# EasyEDA Pro project PCB.epro, board PCB1_1
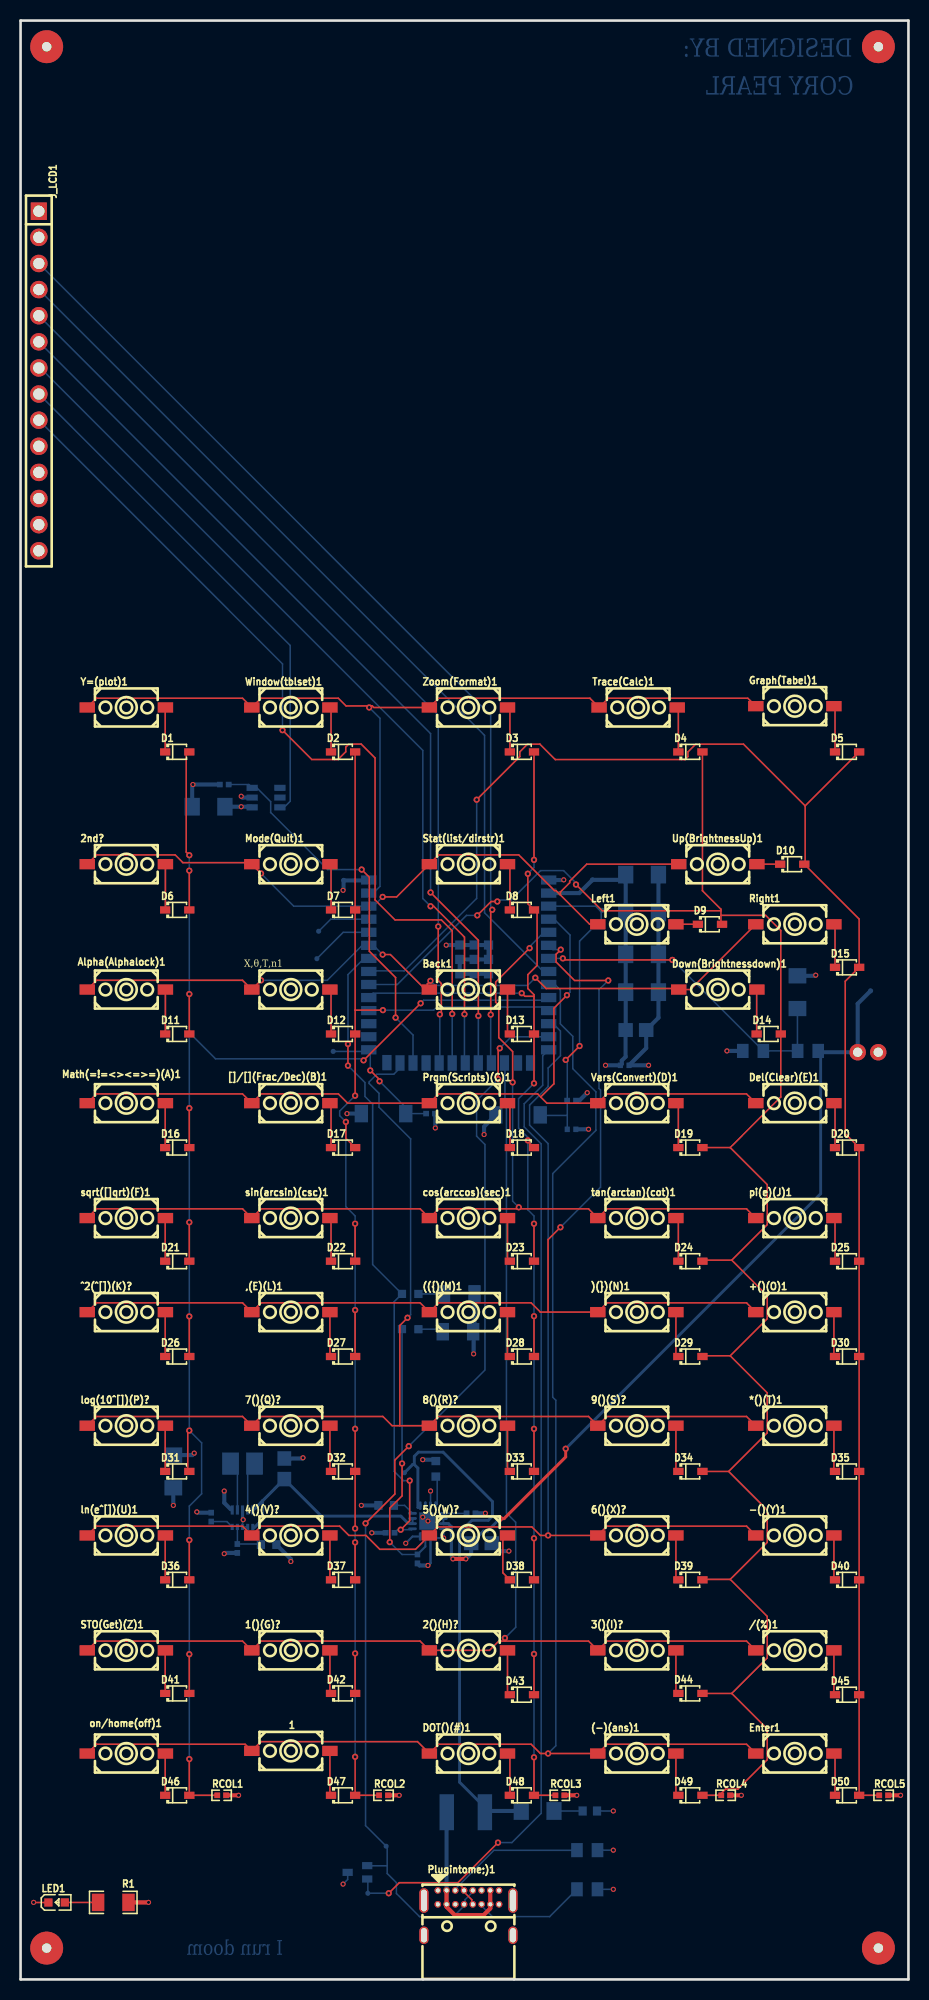
[diagram p1: board, top side]
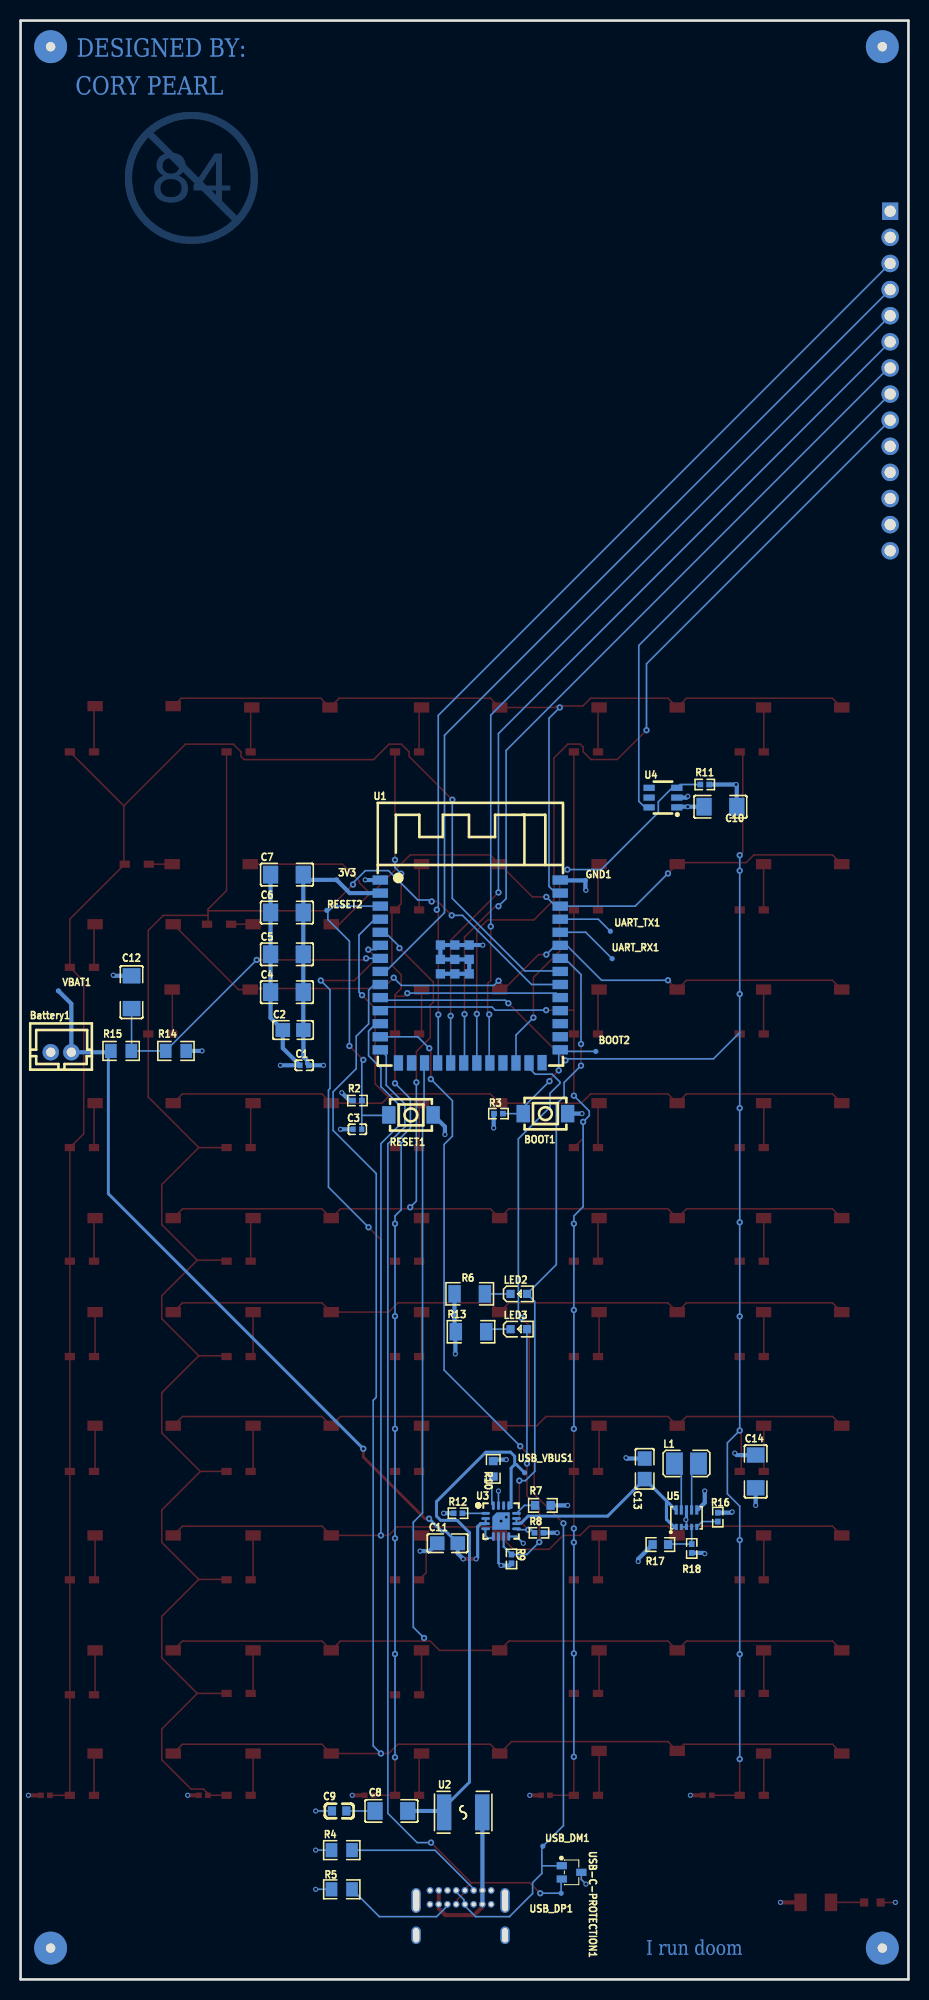
[diagram p2: board, bottom side, seen from below]

Outline 86.36 x 190.5 mm; copper layers: Top Layer, Inner1, Inner2, Bottom Layer. Coordinates in mm from the lower left corner of the outline.
Outline path: 0,190.5 86.36,190.5 86.36,0 0,0 0,190.5
Stack: Top Layer 0.035mm Outer layer thickness 1oz / Dielectric1 0.2104mm 7628 RC49% 8.6mil / Inner1 0.0152mm Inner layer thickness / Dielectric2 1.065mm 1.1mm H/HOZ Copper / Inner2 0.0152mm Inner layer thickness / Dielectric3 0.2104mm 7628 RC49% 8.6mil / Bottom Layer 0.035mm Outer layer thickness 1oz

## Design rules (mm)
template: User Custom Config
spacing copperThickness1oz (default): track to track 0.2, other pairs 0.2 to 0.3
spacing copperThickness2oz: track to track 0.254, other pairs 0.254 to 0.3
track width copperThickness1oz (default): min 0.127, default 0.15, max 2.54
track width copperThickness2oz: min 0.203, default 0.203, max 2.54
track width Power_Lines: min 0.2, default 0.4, max 0.5
differential pair differentialPair (default): width min 0.127, default 0.127, max 2.54; gap min 0.152, default 0.152
via viaSize (default): diameter min 0.5, default 0.61, max 10; hole min 0.3, default 0.305, max 6.3
net 3V3 uses Power_Lines
net VSYS uses Power_Lines
net USB_VBUS uses Power_Lines
net VBAT uses Power_Lines
net VBUS_FUSE uses Power_Lines

## Placement (name value [footprint] x y rotation side)
1  BUTTON  [KEY-SMD_L6.2-W3.6-LS8.0_K2-1107ST-A4SW-06]  26.29 22.22 0 top
1()(G)?  BUTTON  [KEY-SMD_L6.2-W3.6-LS8.0_K2-1107ST-A4SW-06]  26.29 32 0 top
2()(H)?  BUTTON  [KEY-SMD_L6.2-W3.6-LS8.0_K2-1107ST-A4SW-06]  43.56 32 0 top
2nd?  BUTTON  [KEY-SMD_L6.2-W3.6-LS8.0_K2-1107ST-A4SW-06]  10.29 108.46 0 top
3()(I)?  BUTTON  [KEY-SMD_L6.2-W3.6-LS8.0_K2-1107ST-A4SW-06]  59.94 32 0 top
3V3  Test-Point  [Test-Point-0.5mm]  55.63 106.93 180 bottom
4()(V)?  BUTTON  [KEY-SMD_L6.2-W3.6-LS8.0_K2-1107ST-A4SW-06]  26.29 43.18 0 top
5()(W)?  BUTTON  [KEY-SMD_L6.2-W3.6-LS8.0_K2-1107ST-A4SW-06]  43.56 43.18 0 top
6()(X)?  BUTTON  [KEY-SMD_L6.2-W3.6-LS8.0_K2-1107ST-A4SW-06]  59.94 43.18 0 top
7()(Q)?  BUTTON  [KEY-SMD_L6.2-W3.6-LS8.0_K2-1107ST-A4SW-06]  26.29 53.85 0 top
8()(R)?  BUTTON  [KEY-SMD_L6.2-W3.6-LS8.0_K2-1107ST-A4SW-06]  43.56 53.85 0 top
9()(S)?  BUTTON  [KEY-SMD_L6.2-W3.6-LS8.0_K2-1107ST-A4SW-06]  59.94 53.85 0 top
(({)(M)1  BUTTON  [KEY-SMD_L6.2-W3.6-LS8.0_K2-1107ST-A4SW-06]  43.56 64.9 0 top
(-)(ans)1  BUTTON  [KEY-SMD_L6.2-W3.6-LS8.0_K2-1107ST-A4SW-06]  59.94 21.97 0 top
)(})(N)1  BUTTON  [KEY-SMD_L6.2-W3.6-LS8.0_K2-1107ST-A4SW-06]  59.94 64.9 0 top
*()(T)1  BUTTON  [KEY-SMD_L6.2-W3.6-LS8.0_K2-1107ST-A4SW-06]  75.31 53.85 0 top
+()(O)1  BUTTON  [KEY-SMD_L6.2-W3.6-LS8.0_K2-1107ST-A4SW-06]  75.31 64.9 0 top
,(E)(L)1  BUTTON  [KEY-SMD_L6.2-W3.6-LS8.0_K2-1107ST-A4SW-06]  26.29 64.9 0 top
-()(Y)1  BUTTON  [KEY-SMD_L6.2-W3.6-LS8.0_K2-1107ST-A4SW-06]  75.31 43.18 0 top
/(%)1  BUTTON  [KEY-SMD_L6.2-W3.6-LS8.0_K2-1107ST-A4SW-06]  75.31 32 0 top
[]/[](Frac/Dec)(B)1  BUTTON  [KEY-SMD_L6.2-W3.6-LS8.0_K2-1107ST-A4SW-06]  26.29 85.22 0 top
^2(^[])(K)?  BUTTON  [KEY-SMD_L6.2-W3.6-LS8.0_K2-1107ST-A4SW-06]  10.29 64.9 0 top
Alpha(Alphalock)1  BUTTON  [KEY-SMD_L6.2-W3.6-LS8.0_K2-1107ST-A4SW-06]  10.29 96.27 0 top
Back1  BUTTON  [KEY-SMD_L6.2-W3.6-LS8.0_K2-1107ST-A4SW-06]  43.56 96.27 0 top
Battery1  XY-B2B-PH-K-S  [CONN-TH_B2B-PH-K-S]  82.42 90.17 180 bottom
BOOT1  BUT_BOOT  [KEY-SMD_L4.0-W3.0-LS4.9-1]  35.31 84.2 180 bottom
BOOT2  Test-Point  [Test-Point-0.5mm]  30.41 90.25 180 bottom
C1  1uF  [C0402]  58.76 88.9 180 bottom
C2  10uF  [C0805]  59.85 92.33 180 bottom
C3  1uF  [C0402]  53.59 82.68 0 bottom
C4  100nF  [C1206]  60.45 96.01 180 bottom
C5  100nF  [C1206]  60.45 99.69 180 bottom
C6  100nF  [C1206]  60.45 103.76 180 bottom
C7  100nF  [C1206]  60.45 107.44 180 bottom
C8  100nF  [C1206]  50.29 16.38 0 bottom
C9  4.7uF  [C0603]  55.37 16.38 0 bottom
C10  100nF  [C1206]  18.29 114.05 180 bottom
C11  10uF  [C0805]  44.83 42.42 0 bottom
C12  100nF  [C1206]  75.57 96.01 90 bottom
C13  10uF  [C0805]  25.65 49.66 90 bottom
C14  22uF  [C1206]  14.86 49.4 90 bottom
cos(arccos)(sec)1  BUTTON  [KEY-SMD_L6.2-W3.6-LS8.0_K2-1107ST-A4SW-06]  43.56 74.04 0 top
D1  Diode  [SOD-323_L1.8-W1.3-LS2.5-RD]  15.24 119.38 0 top
D2  Diode  [SOD-323_L1.8-W1.3-LS2.5-RD]  31.37 119.38 0 top
D3  Diode  [SOD-323_L1.8-W1.3-LS2.5-RD]  48.77 119.38 0 top
D4  Diode  [SOD-323_L1.8-W1.3-LS2.5-RD]  65.15 119.38 0 top
D5  Diode  [SOD-323_L1.8-W1.3-LS2.5-RD]  80.39 119.38 0 top
D6  Diode  [SOD-323_L1.8-W1.3-LS2.5-RD]  15.24 104.01 0 top
D7  Diode  [SOD-323_L1.8-W1.3-LS2.5-RD]  31.37 104.01 0 top
D8  Diode  [SOD-323_L1.8-W1.3-LS2.5-RD]  48.77 104.01 0 top
D9  Diode  [SOD-323_L1.8-W1.3-LS2.5-RD]  67.06 102.62 0 top
D10  Diode  [SOD-323_L1.8-W1.3-LS2.5-RD]  75.06 108.46 0 top
D11  Diode  [SOD-323_L1.8-W1.3-LS2.5-RD]  15.24 91.95 0 top
D12  Diode  [SOD-323_L1.8-W1.3-LS2.5-RD]  31.37 91.95 0 top
D13  Diode  [SOD-323_L1.8-W1.3-LS2.5-RD]  48.77 91.95 0 top
D14  Diode  [SOD-323_L1.8-W1.3-LS2.5-RD]  72.77 91.95 0 top
D15  Diode  [SOD-323_L1.8-W1.3-LS2.5-RD]  80.39 98.42 0 top
D16  Diode  [SOD-323_L1.8-W1.3-LS2.5-RD]  15.24 80.9 0 top
D17  Diode  [SOD-323_L1.8-W1.3-LS2.5-RD]  31.37 80.9 0 top
D18  Diode  [SOD-323_L1.8-W1.3-LS2.5-RD]  48.77 80.9 0 top
D19  Diode  [SOD-323_L1.8-W1.3-LS2.5-RD]  65.15 80.9 0 top
D20  Diode  [SOD-323_L1.8-W1.3-LS2.5-RD]  80.39 80.9 0 top
D21  Diode  [SOD-323_L1.8-W1.3-LS2.5-RD]  15.24 69.85 0 top
D22  Diode  [SOD-323_L1.8-W1.3-LS2.5-RD]  31.37 69.85 0 top
D23  Diode  [SOD-323_L1.8-W1.3-LS2.5-RD]  48.77 69.85 0 top
D24  Diode  [SOD-323_L1.8-W1.3-LS2.5-RD]  65.15 69.85 0 top
D25  Diode  [SOD-323_L1.8-W1.3-LS2.5-RD]  80.39 69.85 0 top
D26  Diode  [SOD-323_L1.8-W1.3-LS2.5-RD]  15.24 60.58 0 top
D27  Diode  [SOD-323_L1.8-W1.3-LS2.5-RD]  31.37 60.58 0 top
D28  Diode  [SOD-323_L1.8-W1.3-LS2.5-RD]  48.77 60.58 0 top
D29  Diode  [SOD-323_L1.8-W1.3-LS2.5-RD]  65.15 60.58 0 top
D30  Diode  [SOD-323_L1.8-W1.3-LS2.5-RD]  80.39 60.58 0 top
D31  Diode  [SOD-323_L1.8-W1.3-LS2.5-RD]  15.24 49.4 0 top
D32  Diode  [SOD-323_L1.8-W1.3-LS2.5-RD]  31.37 49.4 0 top
D33  Diode  [SOD-323_L1.8-W1.3-LS2.5-RD]  48.77 49.4 0 top
D34  Diode  [SOD-323_L1.8-W1.3-LS2.5-RD]  65.15 49.4 0 top
D35  Diode  [SOD-323_L1.8-W1.3-LS2.5-RD]  80.39 49.4 0 top
D36  Diode  [SOD-323_L1.8-W1.3-LS2.5-RD]  15.24 38.86 0 top
D37  Diode  [SOD-323_L1.8-W1.3-LS2.5-RD]  31.37 38.86 0 top
D38  Diode  [SOD-323_L1.8-W1.3-LS2.5-RD]  48.77 38.86 0 top
D39  Diode  [SOD-323_L1.8-W1.3-LS2.5-RD]  65.15 38.86 0 top
D40  Diode  [SOD-323_L1.8-W1.3-LS2.5-RD]  80.39 38.86 0 top
D41  Diode  [SOD-323_L1.8-W1.3-LS2.5-RD]  15.24 27.81 0 top
D42  Diode  [SOD-323_L1.8-W1.3-LS2.5-RD]  31.37 27.81 0 top
D43  Diode  [SOD-323_L1.8-W1.3-LS2.5-RD]  48.77 27.69 0 top
D44  Diode  [SOD-323_L1.8-W1.3-LS2.5-RD]  65.15 27.81 0 top
D45  Diode  [SOD-323_L1.8-W1.3-LS2.5-RD]  80.39 27.69 0 top
D46  Diode  [SOD-323_L1.8-W1.3-LS2.5-RD]  15.24 17.91 0 top
D47  Diode  [SOD-323_L1.8-W1.3-LS2.5-RD]  31.37 17.91 0 top
D48  Diode  [SOD-323_L1.8-W1.3-LS2.5-RD]  48.77 17.91 0 top
D49  Diode  [SOD-323_L1.8-W1.3-LS2.5-RD]  65.15 17.91 0 top
D50  Diode  [SOD-323_L1.8-W1.3-LS2.5-RD]  80.39 17.91 0 top
Del(Clear)(E)1  BUTTON  [KEY-SMD_L6.2-W3.6-LS8.0_K2-1107ST-A4SW-06]  75.31 85.22 0 top
DOT()(#)1  BUTTON  [KEY-SMD_L6.2-W3.6-LS8.0_K2-1107ST-A4SW-06]  43.56 21.97 0 top
Down(Brightnessdown)1  BUTTON  [KEY-SMD_L6.2-W3.6-LS8.0_K2-1107ST-A4SW-06]  67.82 96.27 0 top
Enter1  BUTTON  [KEY-SMD_L6.2-W3.6-LS8.0_K2-1107ST-A4SW-06]  75.31 21.97 0 top
GND1  Test-Point  [Test-Point-0.5mm]  31.42 106.88 180 bottom
Graph(Tabel)1  BUTTON  [KEY-SMD_L6.2-W3.6-LS8.0_K2-1107ST-A4SW-06]  75.31 123.82 0 top
J_LCD1  2.54-1*14P母  [HDR-TH_14P-P2.54-V-F-1]  1.78 155.45 270 top
L1  470nH  [L1008]  21.59 50.16 180 bottom
LED1  -  [LED_0603]  3.56 7.49 0 top
LED2  -  [LED_0603]  37.85 66.67 180 bottom
LED3  -  [LED_0603]  37.85 63.25 180 bottom
Left1  BUTTON  [KEY-SMD_L6.2-W3.6-LS8.0_K2-1107ST-A4SW-06]  59.94 102.62 0 top
ln(e^[])(U)1  BUTTON  [KEY-SMD_L6.2-W3.6-LS8.0_K2-1107ST-A4SW-06]  10.29 43.18 0 top
log(10^[])(P)?  BUTTON  [KEY-SMD_L6.2-W3.6-LS8.0_K2-1107ST-A4SW-06]  10.29 53.85 0 top
Math(=!=<><=>=)(A)1  BUTTON  [KEY-SMD_L6.2-W3.6-LS8.0_K2-1107ST-A4SW-06]  10.29 85.22 0 top
Mode(Quit)1  BUTTON  [KEY-SMD_L6.2-W3.6-LS8.0_K2-1107ST-A4SW-06]  26.29 108.46 0 top
NOREF  -  [Pad_ie1]  2.54 187.96 0 top
NOREF#2  -  [Pad_ie4]  83.44 3.05 0 top
NOREF#3  -  [Pad_ie2]  83.44 187.96 0 top
NOREF#4  -  [Pad_ie3]  2.54 3.05 0 top
on/home(off)1  BUTTON  [KEY-SMD_L6.2-W3.6-LS8.0_K2-1107ST-A4SW-06]  10.29 21.97 0 top
pi(e)(J)1  BUTTON  [KEY-SMD_L6.2-W3.6-LS8.0_K2-1107ST-A4SW-06]  75.31 74.04 0 top
Plugintome;)1  USB4085-GF-A  [USC-C-SMD_USB4085-GF-A]  43.56 6.48 0 top
Prgm(Scripts)(C)1  BUTTON  [KEY-SMD_L6.2-W3.6-LS8.0_K2-1107ST-A4SW-06]  43.56 85.22 0 top
R1  1kΩ  [R1206]  9.02 7.49 180 top
R2  10kΩ  [R0402]  53.59 85.47 0 bottom
R3  10kΩ  [R0402]  39.88 84.2 0 bottom
R4  5.1kΩ  [R0805]  55.12 12.57 180 bottom
R5  5.1kΩ  [R0805]  55.12 8.76 0 bottom
R6  1kΩ  [R1206]  42.67 66.67 180 bottom
R7  1.8kΩ  [R0603]  35.56 46.1 0 bottom
R8  10kΩ  [R0402]  35.94 43.43 180 bottom
R9  10kΩ  [R0402]  38.61 40.89 270 bottom
R10  1.8kΩ  [R0603]  40.39 49.66 270 bottom
R11  100kΩ  [R0402]  19.81 116.2 0 bottom
R12  10kΩ  [R0402]  43.82 45.34 180 bottom
R13  1kΩ  [R1206]  42.55 62.99 180 bottom
R14  1MΩ  [R0805]  71.25 90.3 180 bottom
R15  1MΩ  [R0805]  76.58 90.3 180 bottom
R16  100kΩ  [R0402]  18.54 44.96 90 bottom
R17  560kΩ  [R0603]  24.13 42.29 0 bottom
R18  100kΩ  [R0402]  21.08 41.91 90 bottom
RCOL1  10kΩ  [R0402]  19.56 17.91 0 top
RCOL2  10kΩ  [R0402]  35.31 17.91 0 top
RCOL3  10kΩ  [R0402]  52.45 17.91 0 top
RCOL4  10kΩ  [R0402]  68.58 17.91 0 top
RCOL5  10kΩ  [R0402]  83.95 17.91 0 top
RESET1  BUT_RESET  [KEY-SMD_L4.0-W3.0-LS4.9-1]  48.39 84.07 180 bottom
RESET2  Test-Point  [Test-Point-0.5mm]  56.57 103.97 180 bottom
Right1  BUTTON  [KEY-SMD_L6.2-W3.6-LS8.0_K2-1107ST-A4SW-06]  75.31 102.62 0 top
sin(arcsin)(csc)1  BUTTON  [KEY-SMD_L6.2-W3.6-LS8.0_K2-1107ST-A4SW-06]  26.29 74.04 0 top
sqrt([]qrt)(F)1  BUTTON  [KEY-SMD_L6.2-W3.6-LS8.0_K2-1107ST-A4SW-06]  10.29 74.04 0 top
Stat(list/dirstr)1  BUTTON  [KEY-SMD_L6.2-W3.6-LS8.0_K2-1107ST-A4SW-06]  43.56 108.46 0 top
STO(Get)(Z)1  BUTTON  [KEY-SMD_L6.2-W3.6-LS8.0_K2-1107ST-A4SW-06]  10.29 32 0 top
tan(arctan)(cot)1  BUTTON  [KEY-SMD_L6.2-W3.6-LS8.0_K2-1107ST-A4SW-06]  59.94 74.04 0 top
Trace(Calc)1  BUTTON  [KEY-SMD_L6.2-W3.6-LS8.0_K2-1107ST-A4SW-06]  60.07 123.7 0 top
U1  2.4GHz  [WIRELM-SMD_ESP32-S3-WROOM-1]  42.62 98.02 180 bottom
U2  MF-MSMF050-2  [F1812]  43.31 16.26 0 bottom
U3  BQ24074RGTR  [QFN-16_L3.0-W3.0-P0.50-TL-EP1.7]  39.62 44.58 180 bottom
U4  TPS22918DBVR  [SOT-23-6_L2.9-W1.6-P0.95-LS2.8-BR]  23.88 114.93 180 bottom
U5  TPS63802 Buck-Boost Regulator  [VSON-10-HR_L3.0-W2.0-P0.50-BL_TI_DLA]  21.59 44.83 180 bottom
UART_RX1  Test-Point  [Test-Point-0.5mm]  28.82 99.27 180 bottom
UART_TX1  Test-Point  [Test-Point-0.5mm]  28.99 101.94 180 bottom
Up(BrightnessUp)1  BUTTON  [KEY-SMD_L6.2-W3.6-LS8.0_K2-1107ST-A4SW-06]  67.82 108.46 0 top
USB-C-PROTECTION1  TPD2E2U06DCKR  [SC-70-3_L2.0-W1.3-P0.65-LS2.1-BL]  32.77 10.41 270 bottom
USB_DM1  Test-Point  [Test-Point-0.5mm]  35.56 12.95 180 bottom
USB_DP1  Test-Point  [Test-Point-0.5mm]  33.78 8.38 180 bottom
USB_VBUS1  Test-Point  [Test-Point-0.5mm]  37.34 49.28 180 bottom
Vars(Convert)(D)1  BUTTON  [KEY-SMD_L6.2-W3.6-LS8.0_K2-1107ST-A4SW-06]  59.94 85.22 0 top
VBAT1  Test-Point  [Test-Point-0.5mm]  82.68 96.14 180 bottom
Window(tblset)1  BUTTON  [KEY-SMD_L6.2-W3.6-LS8.0_K2-1107ST-A4SW-06]  26.29 123.7 0 top
X,θ,T,n1  BUTTON  [KEY-SMD_L6.2-W3.6-LS8.0_K2-1107ST-A4SW-06]  26.29 96.27 0 top
Y=(plot)1  BUTTON  [KEY-SMD_L6.2-W3.6-LS8.0_K2-1107ST-A4SW-06]  10.29 123.7 0 top
Zoom(Format)1  BUTTON  [KEY-SMD_L6.2-W3.6-LS8.0_K2-1107ST-A4SW-06]  43.56 123.7 0 top

## Footprints (pads in the part's own frame, mm; a bottom-side part is the same pattern mirrored in y, then rotated)
C0402
  rect 0.5x0.54 smd: 1(-0.42,0) 2(0.42,0)
C0603
  rect 0.8x0.9 smd: 1(-0.7,0) 2(0.7,0)
C0805
  rect 1.41x1.35 smd: 1(-1,0) 2(1,0)
C1206
  rect 1.485x1.728 smd: 1(-1.593,0) 2(1.593,0)
CONN-TH_B2B-PH-K-S
  round 1.6 hole 0.9: 1(1,0) 2(-1,0)
F1812
  rect 1.407x3.499 smd: 1(-1.853,0) 2(1.853,0)
HDR-TH_14P-P2.54-V-F-1
  rect 1.7x1.575 hole 1.1: 1(-16.51,0)
  round 1.7 hole 1.1: 2(-13.97,0) 3(-11.43,0) 4(-8.89,0) 5(-6.35,0) 6(-3.81,0) 7(-1.27,0) 8(1.27,0) 9(3.81,0) 10(6.35,0) 11(8.89,0) 12(11.43,0) 13(13.97,0) 14(16.51,0)
KEY-SMD_L4.0-W3.0-LS4.9-1
  rect 1.3x1.7 smd: 1(-2.159,0) 2(2.159,0)
KEY-SMD_L6.2-W3.6-LS8.0_K2-1107ST-A4SW-06
  rect 1.5x1 smd: 1(-3.8,0) 2(3.8,0)
L1008
  rect 1.636x2.159 smd: 1(-1.169,0) 2(1.169,0)
LED_0603
  rect 0.8x0.8 smd: 1(-0.851,-0.01) 2(0.75,-0.005)
Pad_ie1
  round 3.2 hole 0.914: 1(0,0)
Pad_ie2
  round 3.2 hole 0.914: 2(0,0)
Pad_ie3
  round 3.2 hole 0.914: 1(0,0)
Pad_ie4
  round 3.2 hole 0.914: 2(0,0)
QFN-16_L3.0-W3.0-P0.50-TL-EP1.7
  oval 0.85x0.28 smd: 1(-1.5,0.75) 2(-1.5,0.25) 3(-1.5,-0.25) 4(-1.5,-0.75) 9(1.5,-0.75) 10(1.5,-0.25) 11(1.5,0.25) 12(1.5,0.75)
  oval 0.28x0.85 smd: 5(-0.75,-1.5) 6(-0.25,-1.5) 7(0.25,-1.5) 8(0.75,-1.5) 13(0.75,1.5) 14(0.25,1.5) 15(-0.25,1.5) 16(-0.75,1.5)
  round 0.34 smd: 17(0,0)
R0402
  rect 0.566x0.54 smd: 1(-0.433,0) 2(0.433,0)
R0603
  rect 0.806x0.864 smd: 1(-0.753,0) 2(0.753,0)
R0805
  rect 1.133x1.377 smd: 1(-1,0) 2(1,0)
R1206
  rect 1.208x1.701 smd: 1(-1.479,0) 2(1.479,0)
SC-70-3_L2.0-W1.3-P0.65-LS2.1-BL
  rect 0.7x1 smd: 1(-0.65,-0.95) 2(0.65,-0.95) 3(0,0.95)
SOD-323_L1.8-W1.3-LS2.5-RD
  rect 1x0.7 smd: 1(-1.173,0) 2(1.173,0)
SOT-23-6_L2.9-W1.6-P0.95-LS2.8-BR
  rect 1.1x0.6 smd: 1(1.35,-0.95) 2(1.35,0) 3(1.35,0.95) 4(-1.35,0.95) 5(-1.35,0) 6(-1.35,-0.95)
Test-Point-0.5mm
  round 0.5 smd: 1(0,0)
USC-C-SMD_USB4085-GF-A
  round 0.65 hole 0.4: A1(-2.975,2.18) A4(-2.125,2.18) A5(-1.275,2.18) A6(-0.425,2.18) A7(0.425,2.18) A8(1.275,2.18) A9(2.125,2.18) A12(2.975,2.18) B1(2.98,0.83) B4(2.13,0.83) B5(1.28,0.83) B6(0.43,0.83) B7(-0.42,0.83) B8(-1.27,0.83) B9(-2.12,0.83) B12(-2.975,0.83)
  oval 0.9x2.4 hole 0.6x2.1: S1(-4.325,1.2) S1(4.325,1.2)
  oval 0.9x1.7 hole 0.6x1.4: S1(-4.325,-2.18) S1(4.325,-2.18)
VSON-10-HR_L3.0-W2.0-P0.50-BL_TI_DLA
  rect 0.3x0.6 smd: 1(-1,-0.825) 2(-0.5,-0.825) 3(0,-0.825) 4(0.5,-0.825) 5(1,-0.825)
  rect 0.3x0.9 smd: 6(1,0.825) 7(0.5,0.825) 9(-0.5,0.825) 10(-1,0.825)
  rect 0.3x1.3 smd: 8(0,0.625)
WIRELM-SMD_ESP32-S3-WROOM-1
  rect 1.5x0.9 smd: 1(-8.75,8.895) 2(-8.75,7.625) 3(-8.75,6.355) 4(-8.75,5.085) 5(-8.75,3.815) 6(-8.75,2.545) 7(-8.75,1.275) 8(-8.75,0.005) 9(-8.75,-1.265) 10(-8.75,-2.535) 11(-8.75,-3.805) 12(-8.75,-5.075) 13(-8.75,-6.345) 14(-8.75,-7.615) 27(8.75,-7.615) 28(8.75,-6.345) 29(8.75,-5.075) 30(8.75,-3.805) 31(8.75,-2.535) 32(8.75,-1.265) 33(8.75,0.005) 34(8.75,1.275) 35(8.75,2.545) 36(8.75,3.815) 37(8.75,5.085) 38(8.75,6.355) 39(8.75,7.625) 40(8.75,8.895)
  rect 0.9x1.5 smd: 15(-6.985,-8.895) 16(-5.715,-8.895) 17(-4.445,-8.895) 18(-3.175,-8.895) 19(-1.905,-8.895) 20(-0.635,-8.895) 21(0.635,-8.895) 22(1.905,-8.895) 23(3.175,-8.895) 24(4.445,-8.895) 25(5.715,-8.895) 26(6.985,-8.865)
  rect 0.9x0.9 smd: 41(-2.9,-0.225) 41(-2.9,1.175) 41(-2.9,2.575) 41(-1.5,-0.225) 41(-1.5,1.175) 41(-1.5,2.575) 41(-0.1,-0.225) 41(-0.1,1.175) 41(-0.1,2.575)

## Nets
As in the schematic, except:
3V3: 3V3.1 C1.2 C2.2 C4.2 C5.2 C6.2 C7.2 C10.1 C14.2 J_LCD1.1 R1.1 R2.2 R3.2 R8.2 R9.2 R16.2 R17.2 RCOL1.2 RCOL2.2 RCOL3.2 RCOL4.2 RCOL5.2 U1.2 U3.6 U4.1 U5.6
ROW1: 2nd?.1 Left1.1 Mode(Quit)1.1 Stat(list/dirstr)1.1 U1.38 Up(BrightnessUp)1.1
ROW5: (({)(M)1.1 )(})(N)1.1 +()(O)1.1 ,(E)(L)1.1 ^2(^[])(K)?.1 U1.6
ROW6: 7()(Q)?.1 8()(R)?.1 9()(S)?.1 *()(T)1.1 log(10^[])(P)?.1 U1.25
ROW7: 4()(V)?.1 5()(W)?.1 6()(X)?.1 -()(Y)1.1 ln(e^[])(U)1.1 U1.12
ROW8: 1()(G)?.1 2()(H)?.1 3()(I)?.1 /(%)1.1 STO(Get)(Z)1.1 U1.17
$1N201: 2nd?.2 D6.1
$1N221: ^2(^[])(K)?.2 D26.1
$1N222: D31.1 log(10^[])(P)?.2
$1N223: 7()(Q)?.2 D32.1
$1N224: 8()(R)?.2 D33.1
$1N225: 9()(S)?.2 D34.1
$1N228: 6()(X)?.2 D39.1
$1N229: 5()(W)?.2 D38.1
$1N230: 4()(V)?.2 D37.1
$1N233: 1()(G)?.2 D42.1
$1N234: 2()(H)?.2 D43.1
$1N235: 3()(I)?.2 D44.1

Pads without a net: J_LCD1 10 11 12 13 14; NOREF 1; NOREF#2 2; NOREF#3 2; NOREF#4 1; Plugintome;)1 A8 B8; U1 15 16 23 26 28 29 30; U3 14; U4 4 5

## Via types
v1: diameter 0.5, hole 0.3, Top Layer to Bottom Layer, 48 vias
v2: diameter 0.61, hole 0.305, Top Layer to Bottom Layer, 87 vias

## Routing (per net, layer and track width the routed paths; a pad name or vN(x,y) marks a point on that pad's centre or on a via; arc(x,y) is an arc through that point)
3V3: length 54.9
  Top Layer w0.4: RCOL2.2 v1(36.83,17.91) ; RCOL3.2 v1(54.1,17.91) ; RCOL1.2 v1(21.21,17.91) ; R1.1 v1(12.45,7.49) ; RCOL5.2 v1(85.6,17.91) ; RCOL4.2 v1(70.1,17.91)
  Bottom Layer w0.25: U3.6 39.87,40.51 v1(39.62,40.26)
  Bottom Layer w0.4: R2.2 54.36,85.47 v1(55.12,86.23) ; R16.2 17.22,45.39 v1(17.15,45.47) ; U1.2 54.34,105.65 3V3.1 58.35,106.93 C7.2 C6.2 C5.2 C4.2 58.86,92.34 C2.2 58.85,89.73 58.48,89.36 58.48,89.04 58.34,88.9 v1(56.9,88.9) ; U4.1 22.47,114.05 v1(21.46,114.05) C10.1 ; v1(34.16,43.43) R8.2 ; R17.2 26.29,40.89 v1(26.29,40.64) ; 20.45,45.72 19.81,46.35 v1(19.81,47.5) ; v1(39.62,40.26) 38.81,40.26 R9.2 ; C14.2 16.71,51 v1(16.89,51.18) ; R3.2 40.34,84.17 v1(40.34,82.8)
GND: length 84.3
  Top Layer w0.15: LED1.1 1.28,7.48 v1(1.27,7.49)
  Bottom Layer w0.15: U5.8 U5.3 U5.2 ; v1(39.88,47.5) 39.88,46.08 U3.15 ; 56.07,16.38 v1(57.66,16.38) ; v1(57.66,12.57) R4.1 ; R5.2 v1(57.66,8.76) ; USB-C-PROTECTION1.3 31.82,9.72 v1(31.37,9.27)
  Bottom Layer w0.2: U3.8 38.12,43.08 v1(37.47,42.42) ; U3.4 41.15,43.8 v1(41.15,42.93) 40.52,42.93 U3.5
  Bottom Layer w0.4: v1(31.37,105.92) 31.42,105.97 GND1.1 33.83,106.88 U1.40 ; RESET1.2 45.08,82.93 v1(45.08,82.17) ; v1(61.09,88.9) 59.18,88.9 60.85,90.57 C2.1 62.04,93.52 C4.1 C5.1 C6.1 C7.1 ; R10.1 40.25,50.55 v1(39.12,50.55) ; R11.1 v1(16.76,116.2) 16.7,116.14 C10.2 ; C12.2 77.28,97.6 v1(77.34,97.66) ; v1(33.15,46.1) R7.1 ; U1.1 52.81,106.92 v1(52.83,106.93) ; R18.1 19.89,41.48 v1(19.81,41.4) ; v1(31.75,84.2) BOOT1.2 ; v1(27.47,50.73) 27.39,50.66 C13.2 ; C3.2 v1(55.25,82.68) ; U1.41 U1.41 U1.41 U1.41 U1.41 U1.41 U1.41 U1.41 U1.41 41.41,100.6 v1(41.4,100.58) ; v1(21.46,115.06) 21.59,114.93 U4.2 ; C11.2 46.59,41.66 v1(47.5,41.66) ; v1(44.07,60.83) 44.07,62.95 R13.1 44.15,63.12 R6.1 ; C14.1 v1(14.86,46.1) ; R14.2 v1(68.71,90.3) ; R12.1 v1(45.21,45.34)
  vias: v1(21.65,44.71) v1(39.12,44.96) v1(39.62,44.58)
VBAT: length 80.3
  Top Layer w0.28: v2(53.02,51.61) 53.02,50.81 47.02,44.81 v2(46.62,44.81)
  Top Layer w0.4: v1(42.06,40.89) v1(43.31,40.89)
  Bottom Layer w0.2: U3.2 U3.3
  Bottom Layer w0.28: v2(53.02,51.61) 77.82,76.41 77.82,90.17 ; v2(46.62,44.81) 45.42,43.61 45.02,43.61 C11.1
  Bottom Layer w0.3: U3.3 41.13,44.32 41.61,44.32 41.9,44.03 41.9,41.05 v1(42.06,40.89)
  Bottom Layer w0.4: C11.1 43.83,41.42 v1(43.31,40.89) ; R15.1 77.71,90.17 Battery1.1 81.42,94.88 VBAT1.1
VBAT_DIV: length 32.1
  Top Layer w0.15: v2(63.4,99.15) 52.9,99.15 v2(52.75,99.3)
  Bottom Layer w0.15: C12.1 75.57,90.31 R15.2 R14.1 v2(63.4,99.15) ; v2(52.75,99.3) 51.37,99.3
VBUS_FUSE: length 17.2
  Top Layer w0.4: Plugintome;)1.A9 45.69,6.91 45.04,6.26 42.24,6.26 41.44,7.06 Plugintome;)1.A4
  Bottom Layer w0.4: 41.44,7.31 Plugintome;)1.A4 41.44,16.24 U2.1
BOOT: length 13.2
  Top Layer w0.15: v2(34.02,88.4) 34.92,87.5 v2(34.92,87.35)
  Bottom Layer w0.15: v2(34.02,88.4) 34.02,90.2 33.86,90.35 ; R3.1 BOOT1.1 37.47,84.8 v2(34.92,87.35) ; 33.86,90.35 33.77,90.25 BOOT2.1 ; 33.86,90.35 U1.27
CHG_PG: length 26.5
  Top Layer w0.15: v2(35.91,42.53) 35.91,45.83 37.11,47.03 v2(37.11,50.18)
  Bottom Layer w0.15: LED3.2 37.11,63.23 v2(37.11,50.18) ; v2(35.91,42.53) 37.11,41.33 R9.1
  Bottom Layer w0.2: R9.1 39.37,42.09 U3.7
CHG_STAT: length 62.4
  Top Layer w0.15: v2(36.97,43.73) 37.85,44.61 v2(37.85,48.51) ; v2(31.85,88.87) v2(31.85,90.97)
  Bottom Layer w0.15: v2(37.85,48.51) 37.25,48.51 36.35,49.41 36.35,65.92 LED2.2 34.25,69.52 34.25,85.12 33.5,85.87 33.5,87.22 v2(31.85,88.87) ; U1.34 33.79,99.22 33.35,99.22 31.85,97.72 v2(31.85,90.97) ; U3.9 38.03,43.73 36.67,43.73 R8.1
COL0: length 175
  Top Layer w0.15: D1.2 16.11,119.08 16.11,109.63 v2(16.41,109.33) ; v2(16.41,42.73) D36.2 ; RCOL1.1 D46.2 v2(16.41,21.43) ; v2(16.41,64.48) D26.2 ; v2(16.41,84.73) D16.2 ; v2(16.41,31.63) D41.2 ; v2(16.41,95.83) D11.2 ; v2(16.41,53.38) 16.26,53.23 16.26,49.55 D31.2 ; v2(33.36,89.38) v2(38.91,94.93) ; v2(16.41,73.63) D21.2 ; v2(16.41,107.83) D6.2
  Bottom Layer w0.15: 16.41,92.08 18.96,89.53 33.21,89.53 v2(33.36,89.38) ; 16.41,92.08 v2(16.41,95.83) v2(16.41,107.83) v2(16.41,109.33) ; 16.41,92.08 v2(16.41,84.73) v2(16.41,73.63) v2(16.41,64.48) v2(16.41,53.38) 17.61,52.18 17.61,47.23 16.41,46.03 v2(16.41,42.73) v2(16.41,31.63) v2(16.41,21.43) ; v2(38.91,94.93) 39.21,95.23 51.11,95.23 U1.10
COL1: length 142.7
  Top Layer w0.15: v2(32.54,21.65) D47.2 RCOL2.1 ; v2(32.54,31.7) D42.2 ; v2(32.54,53.55) D32.2 v2(32.54,43.85) ; v2(32.54,65.1) D27.2 ; D2.2 D7.2 32.54,94.26 ; v2(32.54,85.95) D12.2 32.54,94.26 ; 32.54,94.26 v2(35.24,94.26) ; D17.2 31.64,81.8 v2(31.64,83.4) ; v2(32.54,42.5) D37.2 ; v2(32.54,73.5) D22.2
  Bottom Layer w0.15: v2(32.54,21.65) v2(32.54,31.7) v2(32.54,42.5) v2(32.54,43.85) ; v2(32.54,85.95) 31.04,84.45 31.04,84 v2(31.64,83.4) 31.64,75.15 32.54,74.25 v2(32.54,73.5) v2(32.54,65.1) v2(32.54,53.55) ; v2(35.24,94.26) 40.19,94.26 40.49,94.56 51.02,94.56 U1.11
COL2: length 143.1
  Top Layer w0.15: v2(49.34,107.53) 49.34,104.61 D8.2 50.24,103.71 50.24,98.61 49.34,97.71 49.34,96.36 49.94,95.76 49.94,95.61 ; D3.2 v2(49.94,108.88) ; RCOL3.1 D48.2 v2(49.94,21.6) ; v2(49.94,31.65) D43.2 ; 49.94,95.61 49.04,95.61 v2(48.74,95.91) ; 49.94,95.61 D13.2 v2(49.94,87.15) ; v2(49.34,81.6) 49.34,81.5 D18.2 ; v2(49.94,64.5) D28.2 ; v2(49.94,53.55) D33.2 ; v2(49.94,73.5) D23.2 ; v2(49.94,42.9) D38.2
  Bottom Layer w0.15: v2(48.74,95.91) 34.3,95.91 U1.31 ; v2(49.94,108.88) 49.94,108.13 v2(49.34,107.53) ; v2(49.94,87.15) 48.44,85.65 48.44,82.8 49.34,81.9 v2(49.34,81.6) 49.34,74.85 49.94,74.25 v2(49.94,73.5) v2(49.94,64.5) v2(49.94,53.55) v2(49.94,42.9) v2(49.94,31.65) v2(49.94,21.6)
COL3: length 187.8
  Top Layer w0.15: 69.02,38.9 72.62,35.3 72.62,31.26 69.17,27.81 ; 69.02,38.9 66.36,38.9 D39.2 ; 69.02,38.9 72.62,42.5 72.62,45.65 68.87,49.4 ; 69.17,69.95 66.42,69.95 D24.2 ; 69.17,69.95 72.62,66.5 72.62,64.25 69.02,60.65 ; 69.17,69.95 72.62,73.4 72.62,77.3 69.02,80.9 ; 69.17,27.81 D44.2 ; 69.17,27.81 72.62,24.36 72.62,21.36 69.77,18.51 68.57,18.51 68.12,18.06 ; 69.02,80.9 D19.2 ; 69.02,80.9 73.94,85.82 D14.2 73.94,102.01 72.47,103.48 68.12,103.48 ; 68.12,18.06 RCOL4.1 ; 68.12,18.06 67.97,17.91 D49.2 ; 68.12,103.48 68.12,102.72 D9.2 ; 68.12,103.48 68.12,103.93 ; 69.02,60.65 72.62,57.05 72.62,53.15 68.87,49.4 ; 69.02,60.65 66.39,60.65 D29.2 ; 68.87,49.4 D34.2 ; 68.12,103.93 68.12,104.08 66.32,105.88 D4.2 ; 68.12,103.93 56.57,103.93 v2(54.02,106.48) ; v2(46.37,104.83) 45.77,104.83 v2(44.42,103.48)
  Bottom Layer w0.15: v2(54.02,106.48) 54.02,106.63 52.82,107.83 50.57,107.83 47.72,104.98 46.52,104.98 v2(46.37,104.83) ; v2(44.42,103.48) 43.37,103.48 36.65,96.76 U1.32
COL4: length 170.4
  Top Layer w0.15: 83.51,17.91 D50.2 D45.2 D40.2 D35.2 D30.2 D25.2 D20.2 80.21,82.25 80.21,97.07 D15.2 81.56,103.12 D10.2 76.31,108.54 76.31,114.13 ; 76.31,114.13 70.31,120.13 65.66,120.13 64.91,119.38 64.91,118.93 64.61,118.63 52.01,118.63 50.51,120.13 49.31,120.13 48.56,119.38 48.56,118.93 v2(44.36,114.73) ; 76.31,114.13 D5.2
  Bottom Layer w0.15: v2(44.36,114.73) 44.36,105.13 37.31,98.08 33.92,98.08 U1.33
LCD_BACKL: length 37.9
  Top Layer w0.15: v2(33.18,107.93) 33.93,107.18 33.93,99.98 36.48,97.43 v2(36.48,93.53)
  Bottom Layer w0.15: R11.2 22.21,116.2 U4.3 22.98,115.88 24.33,114.53 24.33,113.48 29.88,107.93 v2(33.18,107.93) ; v2(36.48,93.53) 38.17,91.84 38.17,89.13
LCD_BACKL_A: length 51
  Bottom Layer w0.15: J_LCD1.8 26.23,129.73 26.23,114.58 25.64,113.98 U4.6
LCD_CS: length 96.1
  Top Layer w0.15: v2(45.88,104.03) 45.73,103.88 v2(45.73,93.83)
  Bottom Layer w0.15: 45.79,89.13 45.73,89.19 v2(45.73,93.83) ; J_LCD1.3 45.73,122.93 45.73,104.18 v2(45.88,104.03)
LCD_DC: length 89
  Top Layer w0.15: v2(40.78,93.85) 40.93,94 40.93,96.85 40.63,97.15 v2(40.63,102.4)
  Bottom Layer w0.15: U1.22 40.78,89.19 v2(40.78,93.85) ; v2(40.63,102.4) 40.63,122.95 J_LCD1.5
LCD_MISO: length 87
  Top Layer w0.15: v2(25.48,121.49) 28.33,118.64 30.88,118.64 31.63,119.39 31.63,119.84 31.93,120.14 33.13,120.14 34.48,118.79 34.48,104.99 36.43,103.04 40.93,103.04 41.98,101.98 v2(41.98,93.89)
  Bottom Layer w0.15: v2(25.48,121.49) 25.48,127.94 J_LCD1.9 ; v2(41.98,93.89) U1.21
LCD_MOSI: length 87.8
  Top Layer w0.15: v2(44.53,93.71) 44.53,101.06 v2(39.88,105.71)
  Bottom Layer w0.15: v2(39.88,105.71) 39.88,121.16 J_LCD1.6 ; v2(44.53,93.71) 44.53,89.13
LCD_RST: length 87.2
  Bottom Layer w0.15: J_LCD1.4 45.13,120.99 45.13,103.74 50.84,98.03 U1.8
LCD_SCLK: length 85
  Top Layer w0.15: v2(39.88,104.37) 40.18,104.37 43.18,101.37 v2(43.18,93.87)
  Bottom Layer w0.15: v2(43.18,93.87) 43.18,89.2 U1.20 ; v2(39.88,104.37) 39.13,105.12 39.13,119.52 1.93,156.72 J_LCD1.7
RESET: length 30.9
  Top Layer w0.15: v2(53.02,89.43) v2(54.37,90.78)
  Bottom Layer w0.15: 56.47,103.83 56.47,103.08 54.37,100.98 v2(54.37,90.78) ; 56.47,103.83 RESET2.1 ; 56.47,103.83 55.92,104.38 U1.3 ; 53.17,82.68 53.17,84.03 ; 53.17,84.03 53.17,85.38 ; 53.17,84.03 50.59,84.03 RESET1.1 ; 53.17,85.38 R2.1 ; 53.17,85.38 53.17,89.28 v2(53.02,89.43)
ROW0: length 87.3
  Top Layer w0.15: Y=(plot)1.1 7.39,124.6 21.59,124.6 Window(tblset)1.1 23.39,124.6 30.91,124.6 31.66,123.85 33.91,123.85 ; Graph(Tabel)1.1 70.74,124.6 57.17,124.6 Trace(Calc)1.1 55.37,124.6 40.66,124.6 Zoom(Format)1.1 34.36,123.7 34.21,123.85 33.91,123.85 ; 33.91,123.85 v2(33.91,123.7)
  Bottom Layer w0.15: U1.39 34.31,105.65 34.96,106.3 34.96,122.65 v2(33.91,123.7)
ROW1: length 70
  Top Layer w0.15: Left1.1 55.35,102.62 52.51,105.46 ; 52.51,105.46 52.51,105.76 53.41,106.66 53.41,106.81 55.06,108.46 Up(BrightnessUp)1.1 ; 52.51,105.46 52.08,105.89 51.93,105.89 48.46,109.36 40.66,109.36 Stat(list/dirstr)1.1 36.58,105.28 v2(35.22,105.28) ; v2(23.39,107.56) Mode(Quit)1.1 22.34,108.61 15.79,108.61 15.04,109.36 7.39,109.36 2nd?.1
  Bottom Layer w0.15: v2(35.22,105.28) 34.32,104.38 U1.38 26.57,104.38 v2(23.39,107.56)
ROW2: length 73.7
  Top Layer w0.15: v2(50.07,97.42) 51.12,96.37 63.92,96.37 Down(Brightnessdown)1.1 65.16,96.27 Right1.1 ; v2(35.22,99.67) 35.97,99.67 39.27,96.37 39.57,96.37 ; 39.57,96.37 Back1.1 ; 39.57,96.37 39.57,96.82 v2(39.87,97.12) ; v2(23.39,97.17) X,θ,T,n1.1 21.59,97.17 7.39,97.17 Alpha(Alphalock)1.1
  Bottom Layer w0.15: v2(39.87,97.12) 40.32,96.67 49.32,96.67 v2(50.07,97.42) ; v2(35.22,99.67) 34.32,100.57 U1.35 33.77,100.47 33.14,100.47 29.84,97.17 v2(23.39,97.17)
ROW3: length 87.6
  Top Layer w0.15: Del(Clear)(E)1.1 70.61,86.12 57.04,86.12 Vars(Convert)(D)1.1 51.19,85.22 50.59,85.82 ; 50.59,85.82 50.29,86.12 40.66,86.12 Prgm(Scripts)(C)1.1 31.81,85.22 30.91,86.12 23.39,86.12 []/[](Frac/Dec)(B)1.1 21.59,86.12 7.39,86.12 Math(=!=<><=>=)(A)1.1 ; 50.59,85.82 51.87,87.1 51.87,94.45 v2(53.14,95.72)
  Bottom Layer w0.15: U1.4 51.91,103.11 53.44,101.57 53.44,96.02 v2(53.14,95.72)
ROW4: length 98.3
  Top Layer w0.15: pi(e)(J)1.1 70.61,74.94 57.04,74.94 tan(arctan)(cot)1.1 55.24,74.94 48.31,74.94 ; 48.31,74.94 v2(48.46,75.09) ; 48.31,74.94 40.66,74.94 cos(arccos)(sec)1.1 38.86,74.94 23.39,74.94 sin(arcsin)(csc)1.1 21.59,74.94 7.39,74.94 sqrt([]qrt)(F)1.1 ; v2(49.51,100.29) 46.21,96.99 46.21,95.04 46.51,94.74 46.51,91.59 47.86,90.24 v2(47.86,87.24)
  Bottom Layer w0.15: U1.5 51.32,101.79 50.86,101.79 49.51,100.44 v2(49.51,100.29) ; v2(47.86,87.24) 47.86,75.69 v2(48.46,75.09)
ROW5: length 111.4
  Top Layer w0.15: v2(52.54,100.15) 52.09,99.7 52.09,98.95 53.89,97.15 v2(57.16,97.15) ; 51.31,64.9 51.31,71.95 v2(52.51,73.15) ; 51.31,64.9 50.56,64.9 49.66,65.8 40.66,65.8 (({)(M)1.1 38.86,65.8 23.39,65.8 ,(E)(L)1.1 21.59,65.8 7.39,65.8 ^2(^[])(K)?.1 ; 51.31,64.9 )(})(N)1.1 57.04,65.8 70.61,65.8 +()(O)1.1
  Bottom Layer w0.15: U1.6 51.79,100.15 v2(52.54,100.15) ; v2(57.16,97.15) 56.26,96.25 56.26,86.65 56.41,86.5 56.41,77.05 v2(52.51,73.15)
ROW6: length 107.6
  Top Layer w0.15: 36.89,53.85 36.14,53.85 35.24,54.75 23.39,54.75 7()(Q)?.1 21.59,54.75 7.39,54.75 log(10^[])(P)?.1 ; 36.89,53.85 36.89,63.6 v2(37.64,64.35) ; 36.89,53.85 8()(R)?.1 40.66,54.75 55.24,54.75 9()(S)?.1 57.04,54.75 70.61,54.75 *()(T)1.1
  Bottom Layer w0.15: v2(37.64,64.35) 37.94,64.65 37.94,81.75 34.86,84.82 34.86,86.17 33.9,87.13 33.9,87.28 34.65,88.03 36.3,88.03 36.9,88.63 U1.25
ROW7: length 121.5
  Top Layer w0.15: -()(Y)1.1 70.61,44.08 57.04,44.08 6()(X)?.1 v2(51.31,43.18) 50.56,43.18 49.73,44.01 40.59,44.01 5()(W)?.1 38.41,41.83 34.94,41.83 33.59,43.18 31.94,43.18 31.04,44.08 23.39,44.08 4()(V)?.1 21.59,44.08 7.39,44.08 ln(e^[])(U)1.1
  Bottom Layer w0.15: v2(51.31,43.18) 51.31,81.28 49.51,83.08 49.51,85.03 51.31,86.83 51.31,88.63 52.51,89.83 52.51,92.23 51.91,92.83 51.48,92.83 U1.12
ROW8: length 125.1
  Top Layer w0.15: 47.11,32.9 55.24,32.9 3()(I)?.1 57.04,32.9 70.61,32.9 /(%)1.1 ; 47.11,32.9 v2(47.11,33.2) ; 47.11,32.9 46.51,32.9 45.61,32 2()(H)?.1 38.86,32.9 23.39,32.9 1()(G)?.1 21.59,32.9 7.39,32.9 STO(Get)(Z)1.1
  Bottom Layer w0.15: U1.17 47.11,89.08 47.11,85.25 47.26,85.1 47.26,45.35 48.16,44.45 48.16,34.25 v2(47.11,33.2)
ROW9: length 147.2
  Top Layer w0.15: on/home(off)1.1 7.39,22.87 21.84,22.87 1.1 23.39,23.12 38.61,23.12 DOT()(#)1.1 40.66,22.87 49.66,22.87 50.56,21.97 v2(51.31,21.97) (-)(ans)1.1 57.04,22.87 70.61,22.87 Enter1.1
  Bottom Layer w0.15: U1.9 51.97,96.76 52.5,96.22 52.5,92.93 53.71,91.72 53.71,88.57 55.96,86.32 55.96,82.57 51.76,78.37 51.76,56.62 52.06,56.32 52.06,22.72 v2(51.31,21.97)
UART_RX: length 6.1
  Bottom Layer w0.15: U1.36 31.39,101.84 UART_RX1.1
UART_TX: length 5.4
  Bottom Layer w0.15: U1.37 30.16,103.11 UART_TX1.1
USB_DM: length 106.5
  Top Layer w0.15: v2(37.76,51.86) 36.41,50.51 36.41,47.21 v2(33.56,44.36) ; v2(46.46,87.56) 46.46,90.41 v2(46.61,90.56)
  Bottom Layer w0.15: v2(46.61,90.56) 47.73,91.68 U1.13 ; v2(33.56,44.36) 33.56,14.96 35.66,12.86 35.66,11.06 ; v2(37.76,51.86) 45.17,59.27 45.17,81.2 44.36,82.01 44.36,85.46 v2(46.46,87.56) ; 35.66,11.06 35.66,10.31 36.56,9.41 36.56,8.36 38.81,6.11 42.09,6.11 43.14,7.16 43.14,7.31 43.24,7.4 43.24,7.76 43.99,8.51 Plugintome;)1.A7 ; 35.66,11.06 33.72,11.06 USB-C-PROTECTION1.1
USB_DP: length 100.1
  Top Layer w0.15: v2(35.81,8.38) 36.84,9.41 42.54,9.41 ; 43.99,7.31 43.89,7.41 43.89,7.76 43.14,8.51 43.14,8.81 42.54,9.41 ; 42.54,9.41 v2(46.44,13.31)
  Bottom Layer w0.15: USB-C-PROTECTION1.2 33.78,9.7 USB_DP1.1 v2(35.81,8.38) ; U1.14 50.79,89.82 50.79,86.96 48.99,85.16 48.99,82.91 50.64,81.26 50.64,16.16 47.79,13.31 v2(46.44,13.31)
USB_VBUS: length 53.6
  Bottom Layer w0.28: USB_VBUS1.1 38.14,50.08 38.3,50.08 ; U3.13 38.65,45.9 38.65,49.73 38.3,50.08 ; 38.3,50.08 38.3,50.88 38.7,51.28 41.1,51.28 45.9,46.48 45.9,45.05 45.5,44.65 43.9,44.65 42.7,43.45 42.7,19.18 45.5,16.38
  Bottom Layer w0.4: C8.1 45.29,16.38 U2.2
VSYS: length 22
  Bottom Layer w0.2: U3.11 U3.10
  Bottom Layer w0.28: C13.1 29.25,45.06 36.99,45.06 37.65,44.4 U3.10
  Bottom Layer w0.3: 23.53,46.54 22.85,45.86 U5.10 ; 23.53,46.54 C13.1 ; 23.53,46.54 23.53,44.74 22.73,43.94
$1N84: length 13.5
  Bottom Layer w0.15: R4.2 54.1,12.56 46.04,12.56 42.29,8.81 Plugintome;)1.A5
$1N85: length 11
  Bottom Layer w0.15: R5.1 51.46,6.11 45.89,6.11 44.84,7.16 44.84,7.31
$1N102: length 2.9
  Bottom Layer w0.15: R10.2 40.52,48.77 40.52,46.23 U3.16
$1N159: length 4.8
  Bottom Layer w0.15: L1.2 21.09,49.5 U5.7
$1N168: length 2.3
  Bottom Layer w0.15: R16.1 20.07,44.52 U5.5
$1N192: length 4.3
  Top Layer w0.15: Y=(plot)1.2 14.07,123.68 D1.1
$1N193: length 4.4
  Top Layer w0.15: D2.1 30.2,123.59 Window(tblset)1.2
$1N194: length 4.4
  Top Layer w0.15: D3.1 47.6,123.46 Zoom(Format)1.2
$1N195: length 4.4
  Top Layer w0.15: D4.1 63.98,123.59 Trace(Calc)1.2
$1N196: length 4.5
  Top Layer w0.15: Graph(Tabel)1.2 79.22,123.72 D5.1
$1N197: length 2.3
  Top Layer w0.15: D10.1 Up(BrightnessUp)1.2
$1N198: length 2.1
  Top Layer w0.15: D9.1 Left1.2
$1N199: length 4.5
  Top Layer w0.15: Stat(list/dirstr)1.2 47.6,108.22 D8.1
$1N200: length 4.5
  Top Layer w0.15: Mode(Quit)1.2 30.2,108.35 D7.1
$1N201: length 4.5
  Top Layer w0.15: D6.1 14.09,104.03 2nd?.2
$1N202: length 4.3
  Top Layer w0.15: Alpha(Alphalock)1.2 14.09,91.97 D11.1
$1N203: length 4.4
  Top Layer w0.15: X,θ,T,n1.2 30.2,96.16 D12.1
$1N204: length 4.4
  Top Layer w0.15: Back1.2 47.36,92.18 D13.1
$1N205: length 4.3
  Top Layer w0.15: D14.1 71.6,96.25 Down(Brightnessdown)1.2
$1N206: length 4.2
  Top Layer w0.15: Right1.2 79.22,102.51 D15.1
$1N207: length 4.4
  Top Layer w0.15: D20.1 79.22,85.11 Del(Clear)(E)1.2
$1N208: length 4.4
  Top Layer w0.15: D19.1 63.98,84.98 Vars(Convert)(D)1.2
$1N209: length 4.4
  Top Layer w0.15: Prgm(Scripts)(C)1.2 47.6,84.98 D18.1
$1N210: length 4.4
  Top Layer w0.15: []/[](Frac/Dec)(B)1.2 30.2,85.11 D17.1
$1N211: length 4.3
  Top Layer w0.15: Math(=!=<><=>=)(A)1.2 14.07,85.2 D16.1
$1N212: length 4.2
  Top Layer w0.15: sqrt([]qrt)(F)1.2 14.07,74.02 D21.1
$1N213: length 4.2
  Top Layer w0.15: sin(arcsin)(csc)1.2 30.2,73.93 D22.1
$1N214: length 4.3
  Top Layer w0.15: D23.1 47.36,70.08 cos(arccos)(sec)1.2
$1N215: length 4.3
  Top Layer w0.15: D24.1 63.98,73.81 tan(arctan)(cot)1.2
$1N216: length 4.2
  Top Layer w0.15: D25.1 79.22,73.93 pi(e)(J)1.2
$1N217: length 4.4
  Top Layer w0.15: +()(O)1.2 79.11,60.69 D30.1
$1N218: length 4.4
  Top Layer w0.15: )(})(N)1.2 63.74,60.81 D29.1
$1N219: length 4.4
  Top Layer w0.15: (({)(M)1.2 47.36,60.81 D28.1
$1N220: length 4.4
  Top Layer w0.15: ,(E)(L)1.2 30.09,60.69 D27.1
$1N221: length 4.3
  Top Layer w0.15: D26.1 14.07,64.88 ^2(^[])(K)?.2
$1N222: length 4.5
  Top Layer w0.15: D31.1 14.07,53.83 log(10^[])(P)?.2
$1N223: length 4.5
  Top Layer w0.15: D32.1 30.09,49.51 7()(Q)?.2
$1N224: length 4.5
  Top Layer w0.15: D33.1 47.36,49.64 8()(R)?.2
$1N225: length 4.5
  Top Layer w0.15: D34.1 63.74,49.64 9()(S)?.2
$1N226: length 4.5
  Top Layer w0.15: *()(T)1.2 79.11,49.51 D35.1
$1N227: length 4.4
  Top Layer w0.15: D40.1 79.11,38.97 -()(Y)1.2
$1N228: length 4.4
  Top Layer w0.15: 6()(X)?.2 63.74,39.1 D39.1
$1N229: length 4.8
  Top Layer w0.15: 5()(W)?.2 46.91,42.73 46.91,39.55 D38.1
$1N230: length 4.4
  Top Layer w0.15: 4()(V)?.2 30.09,38.97 D37.1
$1N231: length 4.3
  Top Layer w0.15: ln(e^[])(U)1.2 14.07,43.16 D36.1
$1N232: length 4.2
  Top Layer w0.15: STO(Get)(Z)1.2 14.07,31.98 D41.1
$1N233: length 4.2
  Top Layer w0.15: D42.1 30.09,27.92 1()(G)?.2
$1N234: length 4.4
  Top Layer w0.15: D43.1 47.36,27.92 2()(H)?.2
$1N235: length 4.3
  Top Layer w0.15: 3()(I)?.2 63.74,28.05 D44.1
$1N236: length 4.4
  Top Layer w0.15: D45.1 79.11,27.79 /(%)1.2
$1N237: length 4.1
  Top Layer w0.15: Enter1.2 79.22,21.86 D50.1
$1N238: length 4.2
  Top Layer w0.15: (-)(ans)1.2 63.74,18.14 D49.1
$1N239: length 4.2
  Top Layer w0.15: D48.1 47.6,21.74 DOT()(#)1.2
$1N240: length 4.4
  Top Layer w0.15: D47.1 30.09,18.01 1.2
$1N241: length 4.1
  Top Layer w0.15: D46.1 14.07,21.95 on/home(off)1.2
$1N22667: length 2.1
  Bottom Layer w0.15: U3.12 37.35,46.1 R7.2
$1N22775: length 2.8
  Bottom Layer w0.15: C8.2 C9.1
$1N23153: length 3.2
  Top Layer w0.15: LED1.2 7.53,7.49
$1N23280: length 2.5
  Bottom Layer w0.15: R6.2 41.18,66.66 LED2.1
$1N28035: length 2.5
  Bottom Layer w0.15: LED3.1 40.82,63.24 R13.2
$1N28086: length 2.3
  Bottom Layer w0.15: U3.1 43.37,45.33 R12.2
$1N37419: length 4.8
  Bottom Layer w0.15: L1.1 22.09,49.5 U5.9
$1N37590: length 4
  Bottom Layer w0.15: R17.1 23.33,42.34 R18.2 21.09,42.35 U5.4

## Copper pours and planes (outline as drawn; the poured copper is in the pictures)
3V3 on Inner2: 0,190.5 86.36,190.5 86.36,0 0,0
GND on Inner1: 0,190.5 86.36,190.5 86.36,0 0,0
(no net) on Bottom Layer: 63.28,181.61 76.2,181.61 76.2,168.78 63.28,168.78

## Text on the board
Bottom Layer: I run doom | DESIGNED BY: | CORY PEARL
